# Altium project 10scm153adp1.PrjPcb
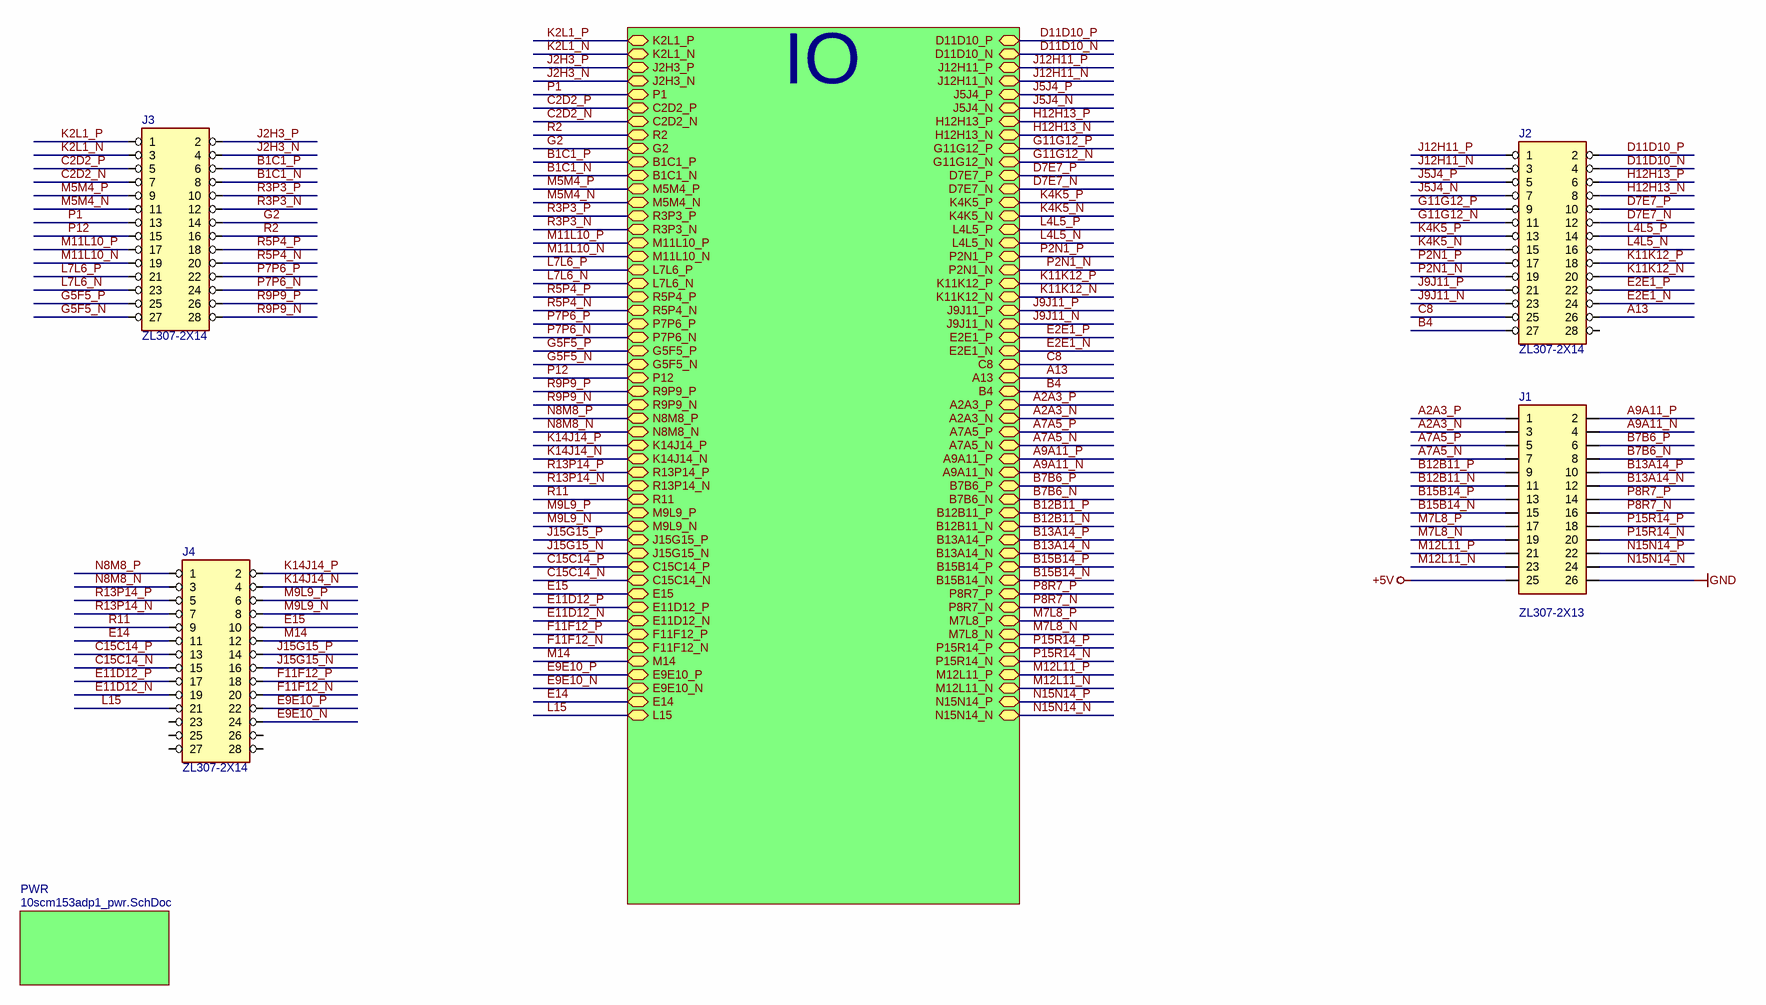
[diagram p0: 10scm153adp1_main.SchDoc]
NazwaModuluSkrot: 10scm153adp1; Projektowal: M. Lach
3 sheets, 36 parts. Net scope: hierarchical (ports join the sheet entries above them; power ports are global).
Board file: 10scm153adp1.PcbDoc
Sheets:
  10scm153adp1_main.SchDoc
    IO = 10scm153adp1_io.SchDoc
    PWR = 10scm153adp1_pwr.SchDoc

## Sheet 10scm153adp1_main.SchDoc
size A3; DocumentNumber: 1; SheetNumber: 1; SheetTotal: 3

### Parts
J1  ZL307-2X13  [ZL307-2X13]
J2  ZL307-2X14  [ZL307-2X14]
J3  ZL307-2X14  [ZL307-2X14]
J4  ZL307-2X14  [ZL307-2X14]

### Sub-sheets
IO = 10scm153adp1_io.SchDoc: P1 (bidir), R2 (bidir), G2 (bidir), P12 (bidir), R11 (bidir), E15 (bidir), M14 (bidir), E14 (bidir), L15 (bidir), C8 (bidir), A13 (bidir), B4 (bidir), M5M4_N (bidir), M5M4_P (bidir), R3P3_N (bidir), R3P3_P (bidir), L7L6_N (bidir), L7L6_P (bidir), R5P4_P (bidir), R5P4_N (bidir), P7P6_P (bidir), P7P6_N (bidir), P8R7_P (bidir), P8R7_N (bidir), M7L8_P (bidir), M7L8_N (bidir), R9P9_N (bidir), R9P9_P (bidir), N8M8_P (bidir), N8M8_N (bidir), P15R14_P (bidir), P15R14_N (bidir), M12L11_P (bidir), M12L11_N (bidir), N15N14_N (bidir), N15N14_P (bidir), K11K12_P (bidir), K11K12_N (bidir), J9J11_N (bidir), J9J11_P (bidir), M9L9_P (bidir), M9L9_N (bidir), M11L10_N (bidir), M11L10_P (bidir), R13P14_P (bidir), R13P14_N (bidir), K14J14_P (bidir), K14J14_N (bidir), J15G15_N (bidir), J15G15_P (bidir), C15C14_N (bidir), C15C14_P (bidir), E11D12_N (bidir), E11D12_P (bidir), F11F12_P (bidir), F11F12_N (bidir), C2D2_N (bidir), C2D2_P (bidir), B1C1_P (bidir), B1C1_N (bidir), E2E1_P (bidir), E2E1_N (bidir), G5F5_N (bidir), G5F5_P (bidir), J2H3_N (bidir), J2H3_P (bidir), K2L1_P (bidir), K2L1_N (bidir), A2A3_N (bidir), A2A3_P (bidir), A7A5_P (bidir), A7A5_N (bidir), A9A11_P (bidir), A9A11_N (bidir), B7B6_P (bidir), B7B6_N (bidir), B12B11_N (bidir), B12B11_P (bidir), B13A14_N (bidir), B13A14_P (bidir), B15B14_N (bidir), B15B14_P (bidir), D7E7_P (bidir), D7E7_N (bidir), D11D10_P (bidir), D11D10_N (bidir), E9E10_P (bidir), E9E10_N (bidir), G11G12_N (bidir), G11G12_P (bidir), H12H13_N (bidir), H12H13_P (bidir), J5J4_P (bidir), J5J4_N (bidir), J12H11_P (bidir), J12H11_N (bidir), K4K5_P (bidir), K4K5_N (bidir), L4L5_P (bidir), L4L5_N (bidir), P2N1_N (bidir), P2N1_P (bidir)
PWR = 10scm153adp1_pwr.SchDoc: no entries

### Nets
+5V: J1.25
GND: J1.26
A2A3_N: J1.3 ; sheet IO/A2A3_N
A2A3_P: J1.1 ; sheet IO/A2A3_P
A7A5_N: J1.7 ; sheet IO/A7A5_N
A7A5_P: J1.5 ; sheet IO/A7A5_P
A9A11_N: J1.4 ; sheet IO/A9A11_N
A9A11_P: J1.2 ; sheet IO/A9A11_P
A13: J2.26 ; sheet IO/A13
B1C1_N: J3.8 ; sheet IO/B1C1_N
B1C1_P: J3.6 ; sheet IO/B1C1_P
B4: J2.27 ; sheet IO/B4
B7B6_N: J1.8 ; sheet IO/B7B6_N
B7B6_P: J1.6 ; sheet IO/B7B6_P
B12B11_N: J1.11 ; sheet IO/B12B11_N
B12B11_P: J1.9 ; sheet IO/B12B11_P
B13A14_N: J1.12 ; sheet IO/B13A14_N
B13A14_P: J1.10 ; sheet IO/B13A14_P
B15B14_N: J1.15 ; sheet IO/B15B14_N
B15B14_P: J1.13 ; sheet IO/B15B14_P
C2D2_N: J3.7 ; sheet IO/C2D2_N
C2D2_P: J3.5 ; sheet IO/C2D2_P
C8: J2.25 ; sheet IO/C8
C15C14_N: J4.15 ; sheet IO/C15C14_N
C15C14_P: J4.13 ; sheet IO/C15C14_P
D7E7_N: J2.12 ; sheet IO/D7E7_N
D7E7_P: J2.10 ; sheet IO/D7E7_P
D11D10_N: J2.4 ; sheet IO/D11D10_N
D11D10_P: J2.2 ; sheet IO/D11D10_P
E2E1_N: J2.24 ; sheet IO/E2E1_N
E2E1_P: J2.22 ; sheet IO/E2E1_P
E9E10_N: J4.24 ; sheet IO/E9E10_N
E9E10_P: J4.22 ; sheet IO/E9E10_P
E11D12_N: J4.19 ; sheet IO/E11D12_N
E11D12_P: J4.17 ; sheet IO/E11D12_P
E14: J4.11 ; sheet IO/E14
E15: J4.10 ; sheet IO/E15
F11F12_N: J4.20 ; sheet IO/F11F12_N
F11F12_P: J4.18 ; sheet IO/F11F12_P
G2: J3.14 ; sheet IO/G2
G5F5_N: J3.27 ; sheet IO/G5F5_N
G5F5_P: J3.25 ; sheet IO/G5F5_P
G11G12_N: J2.11 ; sheet IO/G11G12_N
G11G12_P: J2.9 ; sheet IO/G11G12_P
H12H13_N: J2.8 ; sheet IO/H12H13_N
H12H13_P: J2.6 ; sheet IO/H12H13_P
J2H3_N: J3.4 ; sheet IO/J2H3_N
J2H3_P: J3.2 ; sheet IO/J2H3_P
J5J4_N: J2.7 ; sheet IO/J5J4_N
J5J4_P: J2.5 ; sheet IO/J5J4_P
J9J11_N: J2.23 ; sheet IO/J9J11_N
J9J11_P: J2.21 ; sheet IO/J9J11_P
J12H11_N: J2.3 ; sheet IO/J12H11_N
J12H11_P: J2.1 ; sheet IO/J12H11_P
J15G15_N: J4.16 ; sheet IO/J15G15_N
J15G15_P: J4.14 ; sheet IO/J15G15_P
K2L1_N: J3.3 ; sheet IO/K2L1_N
K2L1_P: J3.1 ; sheet IO/K2L1_P
K4K5_N: J2.15 ; sheet IO/K4K5_N
K4K5_P: J2.13 ; sheet IO/K4K5_P
K11K12_N: J2.20 ; sheet IO/K11K12_N
K11K12_P: J2.18 ; sheet IO/K11K12_P
K14J14_N: J4.4 ; sheet IO/K14J14_N
K14J14_P: J4.2 ; sheet IO/K14J14_P
L4L5_N: J2.16 ; sheet IO/L4L5_N
L4L5_P: J2.14 ; sheet IO/L4L5_P
L7L6_N: J3.23 ; sheet IO/L7L6_N
L7L6_P: J3.21 ; sheet IO/L7L6_P
L15: J4.21 ; sheet IO/L15
M5M4_N: J3.11 ; sheet IO/M5M4_N
M5M4_P: J3.9 ; sheet IO/M5M4_P
M7L8_N: J1.19 ; sheet IO/M7L8_N
M7L8_P: J1.17 ; sheet IO/M7L8_P
M9L9_N: J4.8 ; sheet IO/M9L9_N
M9L9_P: J4.6 ; sheet IO/M9L9_P
M11L10_N: J3.19 ; sheet IO/M11L10_N
M11L10_P: J3.17 ; sheet IO/M11L10_P
M12L11_N: J1.23 ; sheet IO/M12L11_N
M12L11_P: J1.21 ; sheet IO/M12L11_P
M14: J4.12 ; sheet IO/M14
N8M8_N: J4.3 ; sheet IO/N8M8_N
N8M8_P: J4.1 ; sheet IO/N8M8_P
N15N14_N: J1.24 ; sheet IO/N15N14_N
N15N14_P: J1.22 ; sheet IO/N15N14_P
P1: J3.13 ; sheet IO/P1
P2N1_N: J2.19 ; sheet IO/P2N1_N
P2N1_P: J2.17 ; sheet IO/P2N1_P
P7P6_N: J3.24 ; sheet IO/P7P6_N
P7P6_P: J3.22 ; sheet IO/P7P6_P
P8R7_N: J1.16 ; sheet IO/P8R7_N
P8R7_P: J1.14 ; sheet IO/P8R7_P
P12: J3.15 ; sheet IO/P12
P15R14_N: J1.20 ; sheet IO/P15R14_N
P15R14_P: J1.18 ; sheet IO/P15R14_P
R2: J3.16 ; sheet IO/R2
R3P3_N: J3.12 ; sheet IO/R3P3_N
R3P3_P: J3.10 ; sheet IO/R3P3_P
R5P4_N: J3.20 ; sheet IO/R5P4_N
R5P4_P: J3.18 ; sheet IO/R5P4_P
R9P9_N: J3.28 ; sheet IO/R9P9_N
R9P9_P: J3.26 ; sheet IO/R9P9_P
R11: J4.9 ; sheet IO/R11
R13P14_N: J4.7 ; sheet IO/R13P14_N
R13P14_P: J4.5 ; sheet IO/R13P14_P

Not connected (* = marked no-connect by the designer): J2 28; J4 23 25 26 27 28

### Notes on the sheet
- Nazwa modułu (skrót)
- Słowna nazwa modułu
- Rozmiar arkusza
- A3
- Zatwierdził
- Projektował
- Rysował
- Podpis
- ATM
- Data:
- Ark.
- z
- Wer.

### Library data of the parts
J1 = CON85: Kod: CON85; ID: 85; Descript: Gniazdo; kołkowe; żeńskie; PIN: 80; toczone styki; proste; 2,54mm, wycięte 2x13 pinów; Reference5: ZL307-2X40; Typ5: DS1002-03-2*40131; Replacement: bd; Value: ZL307-2X13; Price5: 12; DateOfPrice5: 05-01-2021; Supplier5: tme; Manufacturer5: Connfly
J2-J4 = CON84: Kod: CON84; ID: 84; Descript: Gniazdo; kołkowe; żeńskie; PIN: 80; toczone styki; proste; 2,54mm, wycięte 2x14 pinów; Reference5: ZL307-2X40; Typ5: DS1002-03-2*40131; Replacement: bd; Value: ZL307-2X14; Price5: 20; DateOfPrice5: 05-01-2021; Supplier5: tme; Manufacturer5: Connfly

## Sheet 10scm153adp1_io.SchDoc
size A3; DocumentNumber: 2; SheetNumber: 2; SheetTotal: 3
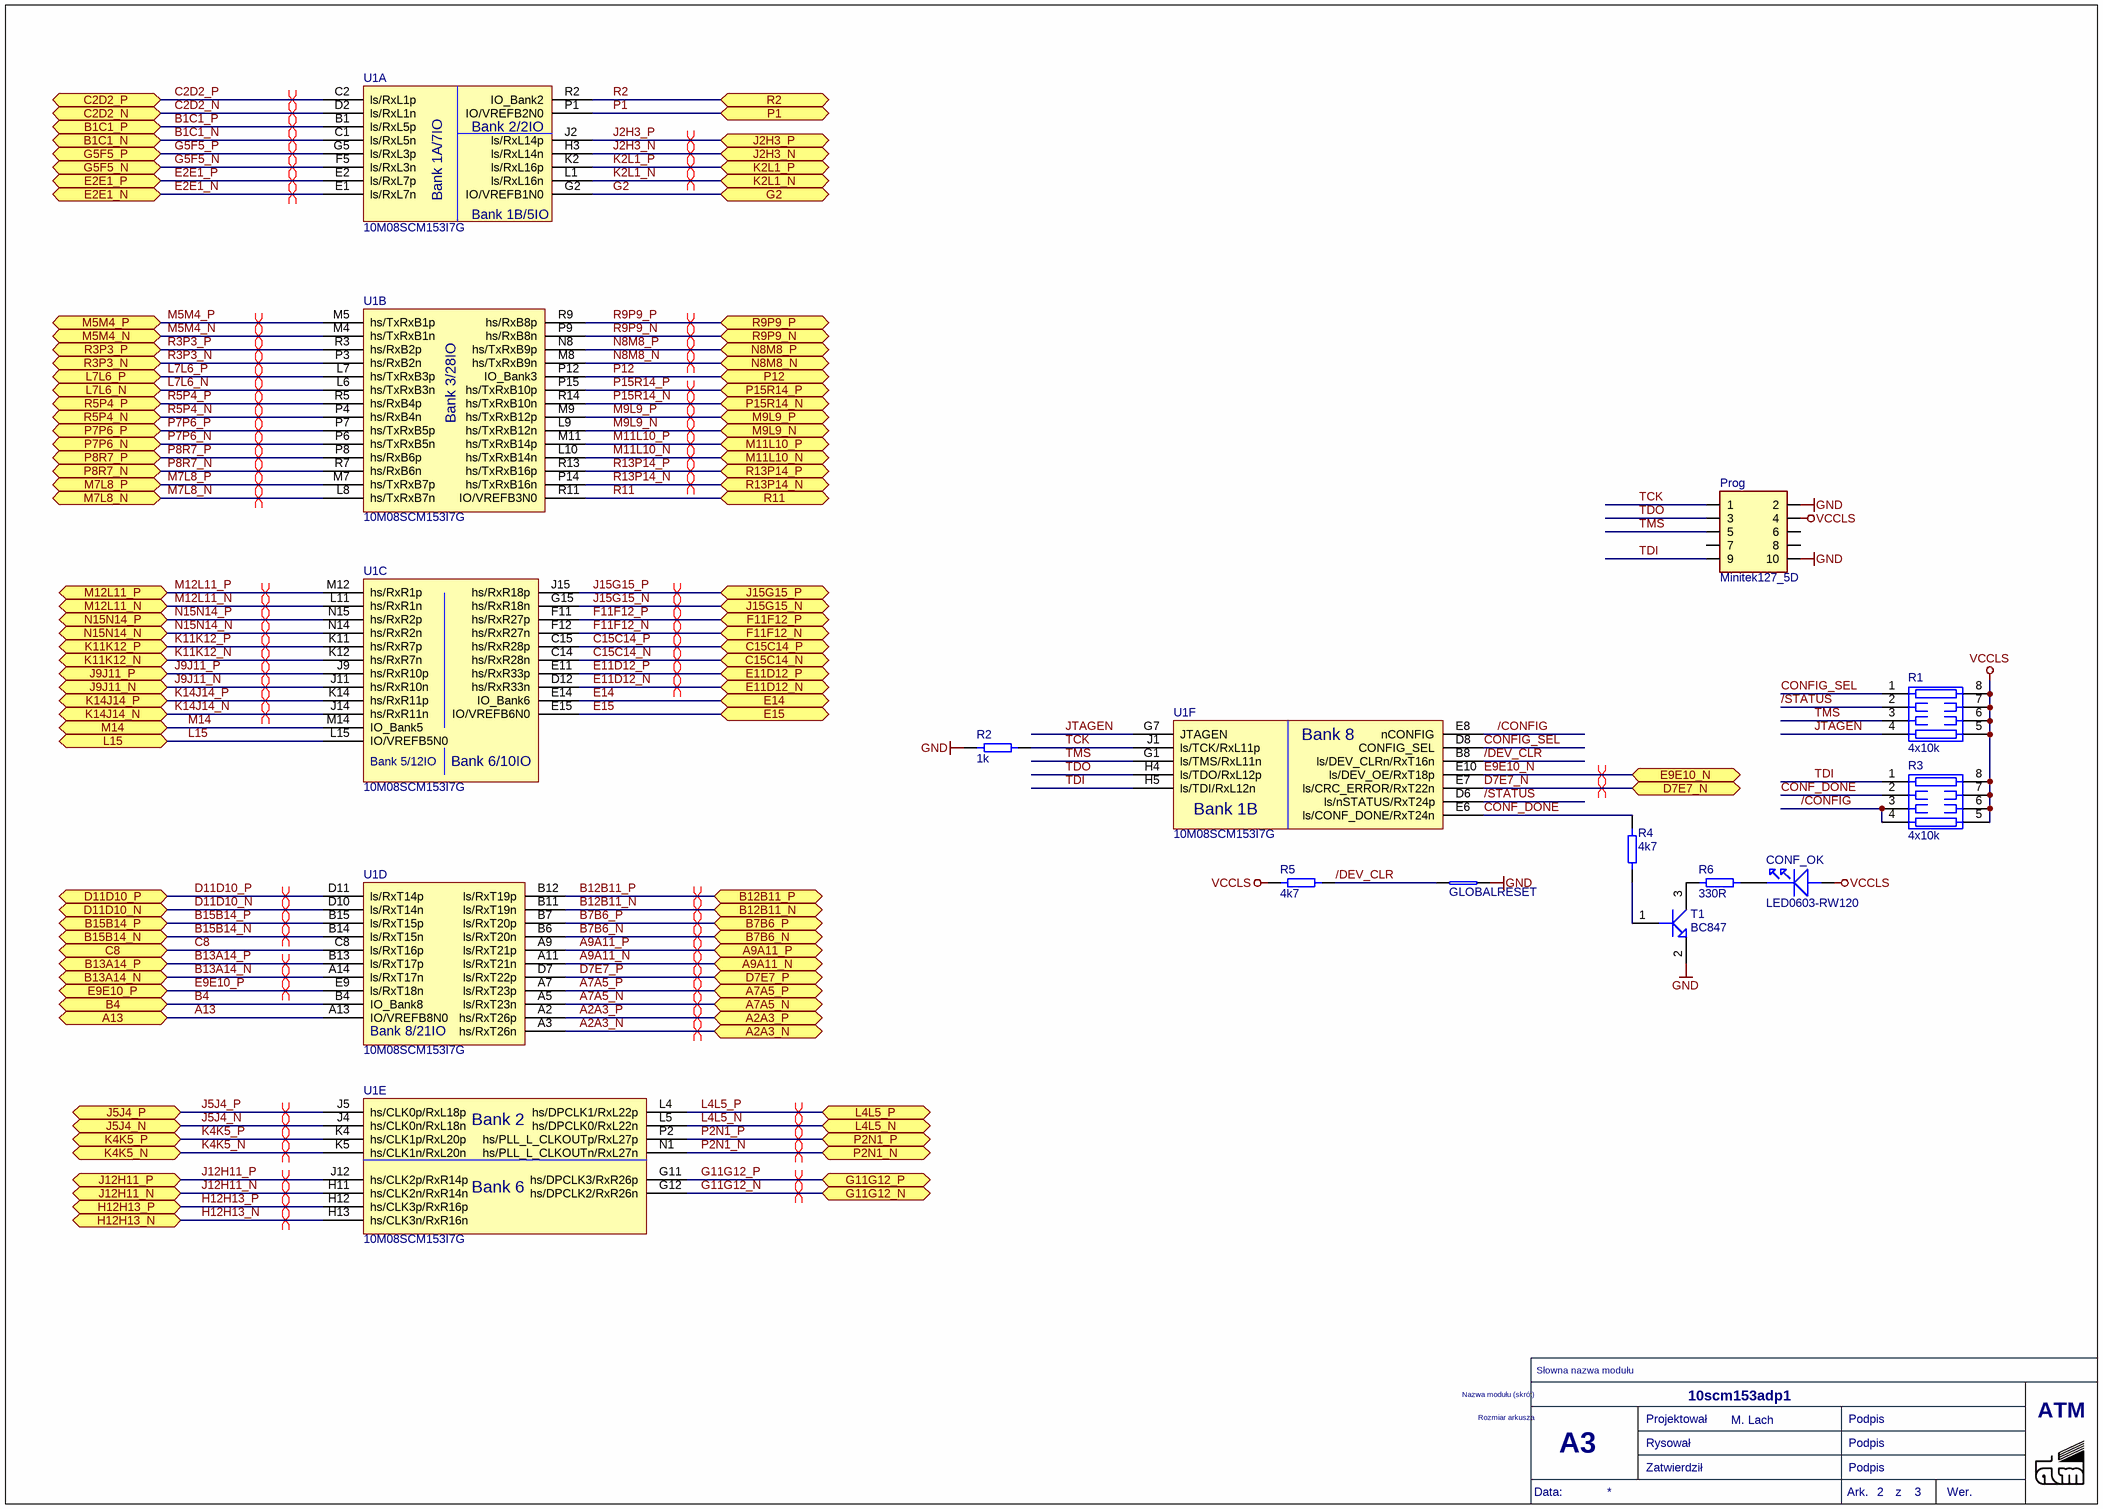
[diagram p1: 10scm153adp1_io.SchDoc]

### Parts
CONF_OK  LED0603-RW120  [D0603]
GLOBALRESET  SHORT0805  [SHORT0805]  (value not drawn)
Prog  Minitek127_5D  [MINITEK127_5D]
R1  4x10k  [1206RP]
R2  1k  [0603R]
R3  4x10k  [1206RP]
R4  4k7  [0603R]
R5  4k7  [0603R]
R6  330R  [0603R]
T1  BC847  [SOT23-3]
U1  10M08SCM153I7G  [MBGA153x15]  (parts A,B,C,D,E,F of 8)

### Ports
A2A3_N (bidir), A2A3_P (bidir), A7A5_N (bidir), A7A5_P (bidir), A9A11_N (bidir), A9A11_P (bidir), A13 (bidir), B1C1_N (bidir), B1C1_P (bidir), B4 (bidir), B7B6_N (bidir), B7B6_P (bidir), B12B11_N (bidir), B12B11_P (bidir), B13A14_N (bidir), B13A14_P (bidir), B15B14_N (bidir), B15B14_P (bidir), C2D2_N (bidir), C2D2_P (bidir), C8 (bidir), C15C14_N (bidir), C15C14_P (bidir), D7E7_N (bidir), D7E7_P (bidir), D11D10_N (bidir), D11D10_P (bidir), E2E1_N (bidir), E2E1_P (bidir), E9E10_N (bidir), E9E10_P (bidir), E11D12_N (bidir), E11D12_P (bidir), E14 (bidir), E15 (bidir), F11F12_N (bidir), F11F12_P (bidir), G2 (bidir), G5F5_N (bidir), G5F5_P (bidir), G11G12_N (bidir), G11G12_P (bidir), H12H13_N (bidir), H12H13_P (bidir), J2H3_N (bidir), J2H3_P (bidir), J5J4_N (bidir), J5J4_P (bidir), J9J11_N (bidir), J9J11_P (bidir), J12H11_N (bidir), J12H11_P (bidir), J15G15_N (bidir), J15G15_P (bidir), K2L1_N (bidir), K2L1_P (bidir), K4K5_N (bidir), K4K5_P (bidir), K11K12_N (bidir), K11K12_P (bidir), K14J14_N (bidir), K14J14_P (bidir), L4L5_N (bidir), L4L5_P (bidir), L7L6_N (bidir), L7L6_P (bidir), L15 (bidir), M5M4_N (bidir), M5M4_P (bidir), M7L8_N (bidir), M7L8_P (bidir), M9L9_N (bidir), M9L9_P (bidir), M11L10_N (bidir), M11L10_P (bidir), M12L11_N (bidir), M12L11_P (bidir), M14 (bidir), N8M8_N (bidir), N8M8_P (bidir), N15N14_N (bidir), N15N14_P (bidir), P1 (bidir), P2N1_N (bidir), P2N1_P (bidir), P7P6_N (bidir), P7P6_P (bidir), P8R7_N (bidir), P8R7_P (bidir), P12 (bidir), P15R14_N (bidir), P15R14_P (bidir), R2 (bidir), R3P3_N (bidir), R3P3_P (bidir), R5P4_N (bidir), R5P4_P (bidir), R9P9_N (bidir), R9P9_P (bidir), R11 (bidir), R13P14_N (bidir), R13P14_P (bidir)

### Nets
GND: GLOBALRESET.2 Prog.2 Prog.10 R2.1 T1.2
VCCLS: CONF_OK.ANOD Prog.4 R1.5(R5) R1.6(R6) R1.7(R7) R1.8(R8) R3.5(R5) R3.6(R6) R3.7(R7) R3.8(R8) R5.2
/CONFIG: R3.3(R3) R3.4(R4) U1.E8(nCONFIG)
/DEV_CLR: GLOBALRESET.1 R5.1 U1.B8(ls/DEV_CLRn/RxT16n)
/STATUS: R1.2(R2) U1.D6(ls/nSTATUS/RxT24p)
A2A3_N: U1.A3(hs/RxT26n) ; port A2A3_N
A2A3_P: U1.A2(hs/RxT26p) ; port A2A3_P
A7A5_N: U1.A5(ls/RxT23n) ; port A7A5_N
A7A5_P: U1.A7(ls/RxT23p) ; port A7A5_P
A9A11_N: U1.A11(ls/RxT21n) ; port A9A11_N
A9A11_P: U1.A9(ls/RxT21p) ; port A9A11_P
A13: U1.A13(IO/VREFB8N0) ; port A13
B1C1_N: U1.C1(ls/RxL5n) ; port B1C1_N
B1C1_P: U1.B1(ls/RxL5p) ; port B1C1_P
B4: U1.B4(IO_Bank8) ; port B4
B7B6_N: U1.B6(ls/RxT20n) ; port B7B6_N
B7B6_P: U1.B7(ls/RxT20p) ; port B7B6_P
B12B11_N: U1.B11(ls/RxT19n) ; port B12B11_N
B12B11_P: U1.B12(ls/RxT19p) ; port B12B11_P
B13A14_N: U1.A14(ls/RxT17n) ; port B13A14_N
B13A14_P: U1.B13(ls/RxT17p) ; port B13A14_P
B15B14_N: U1.B14(ls/RxT15n) ; port B15B14_N
B15B14_P: U1.B15(ls/RxT15p) ; port B15B14_P
C2D2_N: U1.D2(ls/RxL1n) ; port C2D2_N
C2D2_P: U1.C2(ls/RxL1p) ; port C2D2_P
C8: U1.C8(ls/RxT16p) ; port C8
C15C14_N: U1.C14(hs/RxR28n) ; port C15C14_N
C15C14_P: U1.C15(hs/RxR28p) ; port C15C14_P
CONF_DONE: R3.2(R2) R4.1 U1.E6(ls/CONF_DONE/RxT24n)
CONFIG_SEL: R1.1(R1) U1.D8(CONFIG_SEL)
D7E7_N: U1.E7(ls/CRC_ERROR/RxT22n) ; port D7E7_N
D7E7_P: U1.D7(ls/RxT22p) ; port D7E7_P
D11D10_N: U1.D10(ls/RxT14n) ; port D11D10_N
D11D10_P: U1.D11(ls/RxT14p) ; port D11D10_P
E2E1_N: U1.E1(ls/RxL7n) ; port E2E1_N
E2E1_P: U1.E2(ls/RxL7p) ; port E2E1_P
E9E10_N: U1.E10(ls/DEV_OE/RxT18p) ; port E9E10_N
E9E10_P: U1.E9(ls/RxT18n) ; port E9E10_P
E11D12_N: U1.D12(hs/RxR33n) ; port E11D12_N
E11D12_P: U1.E11(hs/RxR33p) ; port E11D12_P
E14: U1.E14(IO_Bank6) ; port E14
E15: U1.E15(IO/VREFB6N0) ; port E15
F11F12_N: U1.F12(hs/RxR27n) ; port F11F12_N
F11F12_P: U1.F11(hs/RxR27p) ; port F11F12_P
G2: U1.G2(IO/VREFB1N0) ; port G2
G5F5_N: U1.F5(ls/RxL3n) ; port G5F5_N
G5F5_P: U1.G5(ls/RxL3p) ; port G5F5_P
G11G12_N: U1.G12(hs/DPCLK2/RxR26n) ; port G11G12_N
G11G12_P: U1.G11(hs/DPCLK3/RxR26p) ; port G11G12_P
H12H13_N: U1.H13(hs/CLK3n/RxR16n) ; port H12H13_N
H12H13_P: U1.H12(hs/CLK3p/RxR16p) ; port H12H13_P
J2H3_N: U1.H3(ls/RxL14n) ; port J2H3_N
J2H3_P: U1.J2(ls/RxL14p) ; port J2H3_P
J5J4_N: U1.J4(hs/CLK0n/RxL18n) ; port J5J4_N
J5J4_P: U1.J5(hs/CLK0p/RxL18p) ; port J5J4_P
J9J11_N: U1.J11(hs/RxR10n) ; port J9J11_N
J9J11_P: U1.J9(hs/RxR10p) ; port J9J11_P
J12H11_N: U1.H11(hs/CLK2n/RxR14n) ; port J12H11_N
J12H11_P: U1.J12(hs/CLK2p/RxR14p) ; port J12H11_P
J15G15_N: U1.G15(hs/RxR18n) ; port J15G15_N
J15G15_P: U1.J15(hs/RxR18p) ; port J15G15_P
JTAGEN: R1.4(R4) U1.G7(JTAGEN)
K2L1_N: U1.L1(ls/RxL16n) ; port K2L1_N
K2L1_P: U1.K2(ls/RxL16p) ; port K2L1_P
K4K5_N: U1.K5(hs/CLK1n/RxL20n) ; port K4K5_N
K4K5_P: U1.K4(hs/CLK1p/RxL20p) ; port K4K5_P
K11K12_N: U1.K12(hs/RxR7n) ; port K11K12_N
K11K12_P: U1.K11(hs/RxR7p) ; port K11K12_P
K14J14_N: U1.J14(hs/RxR11n) ; port K14J14_N
K14J14_P: U1.K14(hs/RxR11p) ; port K14J14_P
L4L5_N: U1.L5(hs/DPCLK0/RxL22n) ; port L4L5_N
L4L5_P: U1.L4(hs/DPCLK1/RxL22p) ; port L4L5_P
L7L6_N: U1.L6(hs/TxRxB3n) ; port L7L6_N
L7L6_P: U1.L7(hs/TxRxB3p) ; port L7L6_P
L15: U1.L15(IO/VREFB5N0) ; port L15
M5M4_N: U1.M4(hs/TxRxB1n) ; port M5M4_N
M5M4_P: U1.M5(hs/TxRxB1p) ; port M5M4_P
M7L8_N: U1.L8(hs/TxRxB7n) ; port M7L8_N
M7L8_P: U1.M7(hs/TxRxB7p) ; port M7L8_P
M9L9_N: U1.L9(hs/TxRxB12n) ; port M9L9_N
M9L9_P: U1.M9(hs/TxRxB12p) ; port M9L9_P
M11L10_N: U1.L10(hs/TxRxB14n) ; port M11L10_N
M11L10_P: U1.M11(hs/TxRxB14p) ; port M11L10_P
M12L11_N: U1.L11(hs/RxR1n) ; port M12L11_N
M12L11_P: U1.M12(hs/RxR1p) ; port M12L11_P
M14: U1.M14(IO_Bank5) ; port M14
N8M8_N: U1.M8(hs/TxRxB9n) ; port N8M8_N
N8M8_P: U1.N8(hs/TxRxB9p) ; port N8M8_P
N15N14_N: U1.N14(hs/RxR2n) ; port N15N14_N
N15N14_P: U1.N15(hs/RxR2p) ; port N15N14_P
P1: U1.P1(IO/VREFB2N0) ; port P1
P2N1_N: U1.N1(hs/PLL_L_CLKOUTn/RxL27n) ; port P2N1_N
P2N1_P: U1.P2(hs/PLL_L_CLKOUTp/RxL27p) ; port P2N1_P
P7P6_N: U1.P6(hs/TxRxB5n) ; port P7P6_N
P7P6_P: U1.P7(hs/TxRxB5p) ; port P7P6_P
P8R7_N: U1.R7(hs/RxB6n) ; port P8R7_N
P8R7_P: U1.P8(hs/RxB6p) ; port P8R7_P
P12: U1.P12(IO_Bank3) ; port P12
P15R14_N: U1.R14(hs/TxRxB10n) ; port P15R14_N
P15R14_P: U1.P15(hs/TxRxB10p) ; port P15R14_P
R2: U1.R2(IO_Bank2) ; port R2
R3P3_N: U1.P3(hs/RxB2n) ; port R3P3_N
R3P3_P: U1.R3(hs/RxB2p) ; port R3P3_P
R5P4_N: U1.P4(hs/RxB4n) ; port R5P4_N
R5P4_P: U1.R5(hs/RxB4p) ; port R5P4_P
R9P9_N: U1.P9(hs/RxB8n) ; port R9P9_N
R9P9_P: U1.R9(hs/RxB8p) ; port R9P9_P
R11: U1.R11(IO/VREFB3N0) ; port R11
R13P14_N: U1.P14(hs/TxRxB16n) ; port R13P14_N
R13P14_P: U1.R13(hs/TxRxB16p) ; port R13P14_P
TCK: Prog.1 R2.2 U1.J1(ls/TCK/RxL11p)
TDI: Prog.9 R3.1(R1) U1.H5(ls/TDI/RxL12n)
TDO: Prog.3 U1.H4(ls/TDO/RxL12p)
TMS: Prog.5 R1.3(R3) U1.G1(ls/TMS/RxL11n)
NetCONF_OK_CATH: CONF_OK.CATH R6.2
NetR4_2: R4.2 T1.1
NetR6_1: R6.1 T1.3

Not connected (* = marked no-connect by the designer): Prog 6 7 8

### Layout directives
differential pair: A2A3_N, A2A3_P, A7A5_N, A7A5_P, A9A11_N, A9A11_P, B1C1_N, B1C1_P, B7B6_N, B7B6_P, B12B11_N, B12B11_P, B13A14_N, B13A14_P, B15B14_N, B15B14_P, C2D2_N, C2D2_P, C15C14_N, C15C14_P, D7E7_N, D7E7_P, D11D10_N, D11D10_P, E2E1_N, E2E1_P, E9E10_N, E9E10_P, E11D12_N, E11D12_P, F11F12_N, F11F12_P, G5F5_N, G5F5_P, G11G12_N, G11G12_P, H12H13_N, H12H13_P, J2H3_N, J2H3_P, J5J4_N, J5J4_P, J9J11_N, J9J11_P, J12H11_N, J12H11_P, J15G15_N, J15G15_P, K2L1_N, K2L1_P, K4K5_N, K4K5_P, K11K12_N, K11K12_P, K14J14_N, K14J14_P, L4L5_N, L4L5_P, L7L6_N, L7L6_P, M5M4_N, M5M4_P, M7L8_N, M7L8_P, M9L9_N, M9L9_P, M11L10_N, M11L10_P, M12L11_N, M12L11_P, N8M8_N, N8M8_P, N15N14_N, N15N14_P, P2N1_N, P2N1_P, P7P6_N, P7P6_P, P8R7_N, P8R7_P, P15R14_N, P15R14_P, R3P3_N, R3P3_P, R5P4_N, R5P4_P, R9P9_N, R9P9_P, R13P14_N, R13P14_P

### Notes on the sheet
- Nazwa modułu (skrót)
- Słowna nazwa modułu
- Rozmiar arkusza
- A3
- Zatwierdził
- Projektował
- Rysował
- Podpis
- ATM
- Data:
- Ark.
- z
- Wer.
- (in symbol ICs341, part A) Bank 2/2IO; Bank 1A/7IO; Bank 1B/5IO
- (in symbol ICs341, part B) Bank 3/28IO
- (in symbol ICs341, part C) Bank 5/12IO; Bank 6/10IO
- (in symbol ICs341, part D) Bank 8/21IO
- (in symbol ICs341, part E) Bank 2; Bank 6
- (in symbol ICs341, part F) Bank 8; Bank 1B

### Library data of the parts
CONF_OK = Opt25: Kod: Opt25; ID: 25; Descript: Dioda LED, SMD 0603, Czerwona 626-636nm, 50-70 mCd /10mA, water clear, 120°; Value: LED0603-RW120; Price5: 0,12; DateOfPrice5: 10-05-2020; Supplier5: maritex.com.pl; Reference5: LED0603-RW120; Manufacturer5: Honglitronic; Typ5: LED0603-RW120
GLOBALRESET = Res238: Kod: Res238; ID: 238; Descript: Przewlekana zwora z drutu na planie rezystora 0805; Value: SHORT0805; Price5: 0,1; Supplier5: -; Reference5: -; Manufacturer5: -; Typ5: -
Prog = CON83: Kod: CON83; ID: 83; Descript: Gniazdo; IDC; Minitek127; męskie; PIN: 10; pionowe; 1,27mm; SMT; 2x5; Reference5: 20021221-00010C4LF; Replacement: bd; Value: Minitek127_5D; Price5: 3,5; DateOfPrice5: 29-12-2020; Supplier5: tme; Manufacturer5: Amphenol; Typ5: 20021221-00010C4LF
R1 R3 = Res287: Kod: Res287; ID: 287; Descript: Drabinka rezystorowa: Y; 10kΩ; SMD; 1206; Il.rezystorów: 4; 63mW; Reference5: DR1206-10K-4/8; Typ5: 4D03WGJ0103T5E; Value: 4x10k; Price5: 0,1; DateOfPrice5: 29-12-2020; Supplier5: tme; Manufacturer5: Royal Ohm
R2 = Res52: Kod: Res52; ID: 52; Descript: Rezystor: thick film; SMD; 0603; 1kom; 0,1W; ±1%; -55÷155°C; Reference5: SMD0603-1K-1%; Typ5: 0603SAF1001T5E; Value: 1k; Price5: 0,08; DateOfPrice5: 10-05-2020; Supplier5: tme.pl; Manufacturer5: Royal Ohm
R4 R5 = Res171: Kod: Res171; ID: 171; Descript: Rezystor: thick film; SMD; 0603; 4,7kom; 0,1W; ±1%; -55÷125°C; Reference5: SMD0603-4K7-1%; Typ5: 0603SAF4701T5E; Value: 4k7; Price5: 0,1; DateOfPrice5: 25-06-2020; Supplier5: tme.pl; Manufacturer5: Royal Ohm
R6 = Res127: Kod: Res127; ID: 127; Descript: Rezystor: thick film; SMD; 0603; 330Ω; 0,1W; ±1%; -55÷125°C; Reference5: SMD0603-330R-1%; Typ5: 0603SAF3300T5E; Value: 330R; Price5: 0,1; DateOfPrice5: 25-06-2020; Supplier5: tme.pl; Manufacturer5: Royal Ohm
T1 = Tra11: Kod: Tra11; ID: 11; Descript: SMD transistor 50V 0.1A; Reference5: BC847A.215; Value: BC847; Price5: 0; DateOfPrice5: 01-01-2010; Supplier5: tme.pl; Manufacturer5: NXP; Typ5: BC847A.215
U1 = ICs341: Kod: ICs341; ID: 341; Descript: FPGA - Field Programmable Gate Array non-volatile FPGA, 112 I/O, 153MBGA; Reference5: 989-10M08SCM153I7G; Value: 10M08SCM153I7G; Price5: 100; DateOfPrice5: 29-12-2020; Supplier5: Mouser; Manufacturer5: Intel; Typ5: 10M08SCM153I7G

## Sheet 10scm153adp1_pwr.SchDoc
size A4; DocumentNumber: 3; SheetNumber: 3; SheetTotal: 3
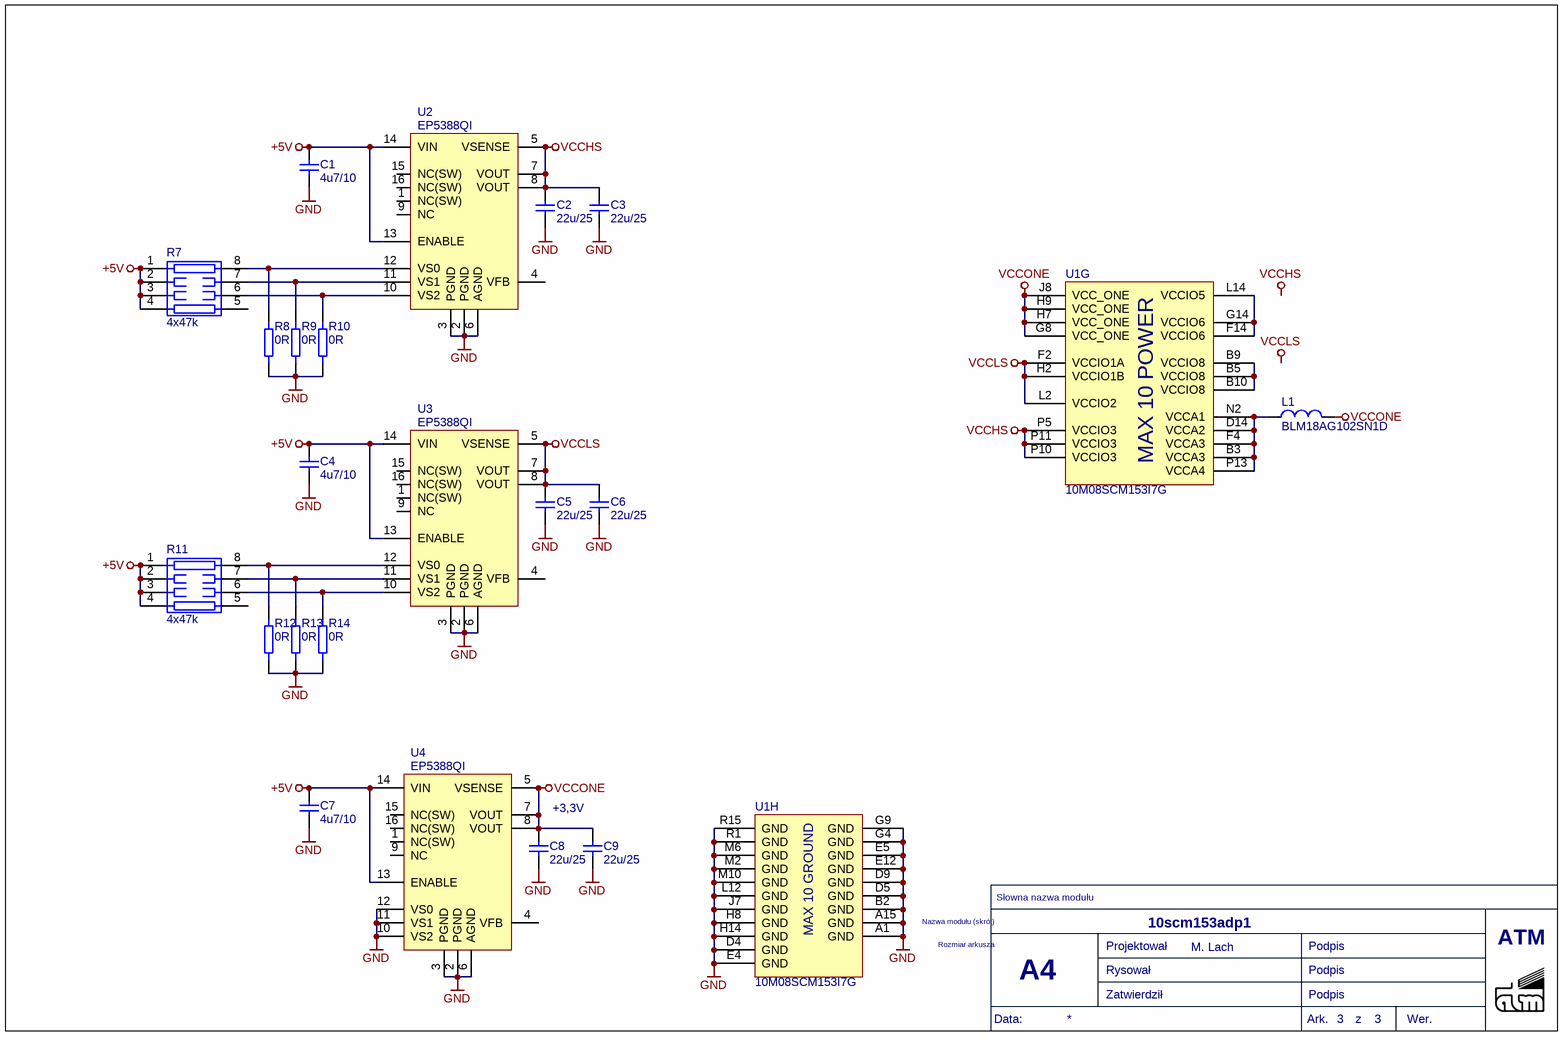
[diagram p2: 10scm153adp1_pwr.SchDoc]

### Parts
C1  4u7/10  [0603-IPC]
C2  22u/25  [0805]
C3  22u/25  [0805]
C4  4u7/10  [0603-IPC]
C5  22u/25  [0805]
C6  22u/25  [0805]
C7  4u7/10  [0603-IPC]
C8  22u/25  [0805]
C9  22u/25  [0805]
L1  BLM18AG102SN1D  [0603-IPC]
R7  4x47k  [1206RP]
R8  0R  [0603R]
R9  0R  [0603R]
R10  0R  [0603R]
R11  4x47k  [1206RP]
R12  0R  [0603R]
R13  0R  [0603R]
R14  0R  [0603R]
U1  10M08SCM153I7G  [MBGA153x15]  (parts G,H of 8)
U2  EP5388QI  [EP5368QI]
U3  EP5388QI  [EP5368QI]
U4  EP5388QI  [EP5368QI]

### Nets
+5V: C1.1 C4.1 C7.1 R7.1(R1) R7.2(R2) R7.3(R3) R7.4(R4) R11.1(R1) R11.2(R2) R11.3(R3) R11.4(R4) U2.13(ENABLE) U2.14(VIN) U3.13(ENABLE) U3.14(VIN) U4.13(ENABLE) U4.14(VIN)
GND: C1.2 C2.2 C3.2 C4.2 C5.2 C6.2 C7.2 C8.2 C9.2 R8.2 R9.2 R10.2 R12.2 R13.2 R14.2 U1.A1(GND) U1.A15(GND) U1.B2(GND) U1.D4(GND) U1.D5(GND) U1.D9(GND) U1.E4(GND) U1.E5(GND) U1.E12(GND) U1.G4(GND) U1.G9(GND) U1.H8(GND) U1.H14(GND) U1.J7(GND) U1.L12(GND) U1.M2(GND) U1.M6(GND) U1.M10(GND) U1.R1(GND) U1.R15(GND) U2.2(PGND) U2.3(PGND) U2.6(AGND) U3.2(PGND) U3.3(PGND) U3.6(AGND) U4.2(PGND) U4.3(PGND) U4.6(AGND) U4.10(VS2) U4.11(VS1) U4.12(VS0)
VCCHS: C2.1 C3.1 U1.P5(VCCIO3) U1.P10(VCCIO3) U1.P11(VCCIO3) U2.5(VSENSE) U2.7(VOUT) U2.8(VOUT)
VCCLS: C5.1 C6.1 U1.F2(VCCIO1A) U1.H2(VCCIO1B) U1.L2(VCCIO2) U3.5(VSENSE) U3.7(VOUT) U3.8(VOUT)
VCCONE: C8.1 C9.1 L1.2 U1.G8(VCC_ONE) U1.H7(VCC_ONE) U1.H9(VCC_ONE) U1.J8(VCC_ONE) U4.5(VSENSE) U4.7(VOUT) U4.8(VOUT)
NetL1_1: L1.1 U1.B3(VCCA3) U1.D14(VCCA2) U1.F4(VCCA3) U1.N2(VCCA1) U1.P13(VCCA4)
NetR7_6: R7.6(R6) R10.1 U2.10(VS2)
NetR7_7: R7.7(R7) R9.1 U2.11(VS1)
NetR7_8: R7.8(R8) R8.1 U2.12(VS0)
NetR11_6: R11.6(R6) R14.1 U3.10(VS2)
NetR11_7: R11.7(R7) R13.1 U3.11(VS1)
NetR11_8: R11.8(R8) R12.1 U3.12(VS0)
NetU1_B5: U1.B5(VCCIO8) U1.B9(VCCIO8) U1.B10(VCCIO8)
NetU1_F14: U1.F14(VCCIO6) U1.G14(VCCIO6) U1.L14(VCCIO5)

Not connected (* = marked no-connect by the designer): R7 5(R5); R11 5(R5); U2 1(NC(SW)) 4(VFB) 9(NC) 15(NC(SW)) 16(NC(SW)); U3 1(NC(SW)) 4(VFB) 9(NC) 15(NC(SW)) 16(NC(SW)); U4 1(NC(SW)) 4(VFB) 9(NC) 15(NC(SW)) 16(NC(SW))

### Notes on the sheet
- +3,3V
- Labels drawn without touching a wire or pin: VCCHS, VCCLS
- Nazwa modułu (skrót)
- Słowna nazwa modułu
- Rozmiar arkusza
- A4
- Zatwierdził
- Projektował
- Rysował
- Podpis
- ATM
- Data:
- Ark.
- z
- Wer.
- (in symbol ICs341, part G) MAX 10 POWER
- (in symbol ICs341, part H) MAX 10 GROUND

### Library data of the parts
C1 C4 C7 = CAP131: Kod: CAP131; ID: 131; Descript: Kondensator: ceramiczny; MLCC; 4,7uF; 10V; X5R; ±10%; SMD; 0603; Reference5: CL10A475KP8NNNC; Value: 4u7/10; Price5: 0; DateOfPrice5: 01-01-2010; Supplier5: tme.pl; Manufacturer5: Samsung; Typ5: CL10A475KP8NNNC
C2 C3 C5 C6 C8 C9 = CAP96: Kod: CAP96; ID: 96; Descript: Kondensator: ceramiczny; MLCC; 22uF; 25V; X5R; ±20%; SMD; 0805; Reference5: CL21A226MAQNNNE; Value: 22u/25; Price5: 1,5; DateOfPrice5: 29-12-2020; Supplier5: tme.pl; Manufacturer5: Samsung; Typ5: CL21A226MAQNNNE
L1 = Ind41: Kod: Ind41; ID: 41; Descript: Ferryt: koralik; Imp.@ 100MHz:1000om; Montaż: SMD; 0,4A; Obud:0603; Value: BLM18AG102SN1D; InductCurr: -; Price5: 0; DateOfPrice5: 10-05-2020; Supplier5: tme.pl; Reference5: BLM18AG102SN1D; Manufacturer5: Murata; Typ5: BLM18AG102SN1D
R7 R11 = Res182: Kod: Res182; ID: 182; Descript: Drabinka rezystorowa: Y; 47kΩ; SMD; 1206; Il.rezystorów:4; 63mW; Reference5: DR1206-47K-4/8; Typ5: 4D03WGJ0473T; Value: 4x47k; Price5: 0,1; DateOfPrice5: 10-05-2020; Supplier5: tme.pl; Manufacturer5: Royal Ohm
R8-R10 R12-R14 = Res1: Kod: Res1; ID: 1; Descript: Rezystor: thick film; SMD; 0603; 0ohm; 0,1W; ±5%; -55÷155°C; Reference5: RC0603JR-070R; Typ5: RC0603JR-070RL; Value: 0R; Price5: 0,1; DateOfPrice5: 25-06-2020; Supplier5: tme.pl; Manufacturer5: Yageo
U1 = ICs341: as U1 on sheet 10scm153adp1_io; Value: 10M08SCM153I7G; Price5: 100; DateOfPrice5: 29-12-2020; Supplier5: Mouser; Manufacturer5: Intel; Typ5: 10M08SCM153I7G
U2-U4 = ICs340: Kod: ICs340; ID: 340; Descript: Switching Voltage Regulators 800mA BUCK REGULATOR INTEGRATED INDUCTOR; Reference5: 884-EP5388QI; Value: EP5388QI; Price5: 15; DateOfPrice5: 29-12-2020; Supplier5: Mouser; Manufacturer5: Intel; Typ5: EP5388QI

## Nets that join several sheets
+5V: 10scm153adp1_main (J1.25), 10scm153adp1_pwr (17 pins)
GND: 10scm153adp1_main (J1.26), 10scm153adp1_io (5 pins), 10scm153adp1_pwr (47 pins)
VCCLS: 10scm153adp1_io (11 pins), 10scm153adp1_pwr (8 pins)
A2A3_N: 10scm153adp1_main (J1.3), 10scm153adp1_io (U1.A3)
A2A3_P: 10scm153adp1_main (J1.1), 10scm153adp1_io (U1.A2)
A7A5_N: 10scm153adp1_main (J1.7), 10scm153adp1_io (U1.A5)
A7A5_P: 10scm153adp1_main (J1.5), 10scm153adp1_io (U1.A7)
A9A11_N: 10scm153adp1_main (J1.4), 10scm153adp1_io (U1.A11)
A9A11_P: 10scm153adp1_main (J1.2), 10scm153adp1_io (U1.A9)
A13: 10scm153adp1_main (J2.26), 10scm153adp1_io (U1.A13)
B1C1_N: 10scm153adp1_main (J3.8), 10scm153adp1_io (U1.C1)
B1C1_P: 10scm153adp1_main (J3.6), 10scm153adp1_io (U1.B1)
B4: 10scm153adp1_main (J2.27), 10scm153adp1_io (U1.B4)
B7B6_N: 10scm153adp1_main (J1.8), 10scm153adp1_io (U1.B6)
B7B6_P: 10scm153adp1_main (J1.6), 10scm153adp1_io (U1.B7)
B12B11_N: 10scm153adp1_main (J1.11), 10scm153adp1_io (U1.B11)
B12B11_P: 10scm153adp1_main (J1.9), 10scm153adp1_io (U1.B12)
B13A14_N: 10scm153adp1_main (J1.12), 10scm153adp1_io (U1.A14)
B13A14_P: 10scm153adp1_main (J1.10), 10scm153adp1_io (U1.B13)
B15B14_N: 10scm153adp1_main (J1.15), 10scm153adp1_io (U1.B14)
B15B14_P: 10scm153adp1_main (J1.13), 10scm153adp1_io (U1.B15)
C2D2_N: 10scm153adp1_main (J3.7), 10scm153adp1_io (U1.D2)
C2D2_P: 10scm153adp1_main (J3.5), 10scm153adp1_io (U1.C2)
C8: 10scm153adp1_main (J2.25), 10scm153adp1_io (U1.C8)
C15C14_N: 10scm153adp1_main (J4.15), 10scm153adp1_io (U1.C14)
C15C14_P: 10scm153adp1_main (J4.13), 10scm153adp1_io (U1.C15)
D7E7_N: 10scm153adp1_main (J2.12), 10scm153adp1_io (U1.E7)
D7E7_P: 10scm153adp1_main (J2.10), 10scm153adp1_io (U1.D7)
D11D10_N: 10scm153adp1_main (J2.4), 10scm153adp1_io (U1.D10)
D11D10_P: 10scm153adp1_main (J2.2), 10scm153adp1_io (U1.D11)
E2E1_N: 10scm153adp1_main (J2.24), 10scm153adp1_io (U1.E1)
E2E1_P: 10scm153adp1_main (J2.22), 10scm153adp1_io (U1.E2)
E9E10_N: 10scm153adp1_main (J4.24), 10scm153adp1_io (U1.E10)
E9E10_P: 10scm153adp1_main (J4.22), 10scm153adp1_io (U1.E9)
E11D12_N: 10scm153adp1_main (J4.19), 10scm153adp1_io (U1.D12)
E11D12_P: 10scm153adp1_main (J4.17), 10scm153adp1_io (U1.E11)
E14: 10scm153adp1_main (J4.11), 10scm153adp1_io (U1.E14)
E15: 10scm153adp1_main (J4.10), 10scm153adp1_io (U1.E15)
F11F12_N: 10scm153adp1_main (J4.20), 10scm153adp1_io (U1.F12)
F11F12_P: 10scm153adp1_main (J4.18), 10scm153adp1_io (U1.F11)
G2: 10scm153adp1_main (J3.14), 10scm153adp1_io (U1.G2)
G5F5_N: 10scm153adp1_main (J3.27), 10scm153adp1_io (U1.F5)
G5F5_P: 10scm153adp1_main (J3.25), 10scm153adp1_io (U1.G5)
G11G12_N: 10scm153adp1_main (J2.11), 10scm153adp1_io (U1.G12)
G11G12_P: 10scm153adp1_main (J2.9), 10scm153adp1_io (U1.G11)
H12H13_N: 10scm153adp1_main (J2.8), 10scm153adp1_io (U1.H13)
H12H13_P: 10scm153adp1_main (J2.6), 10scm153adp1_io (U1.H12)
J2H3_N: 10scm153adp1_main (J3.4), 10scm153adp1_io (U1.H3)
J2H3_P: 10scm153adp1_main (J3.2), 10scm153adp1_io (U1.J2)
J5J4_N: 10scm153adp1_main (J2.7), 10scm153adp1_io (U1.J4)
J5J4_P: 10scm153adp1_main (J2.5), 10scm153adp1_io (U1.J5)
J9J11_N: 10scm153adp1_main (J2.23), 10scm153adp1_io (U1.J11)
J9J11_P: 10scm153adp1_main (J2.21), 10scm153adp1_io (U1.J9)
J12H11_N: 10scm153adp1_main (J2.3), 10scm153adp1_io (U1.H11)
J12H11_P: 10scm153adp1_main (J2.1), 10scm153adp1_io (U1.J12)
J15G15_N: 10scm153adp1_main (J4.16), 10scm153adp1_io (U1.G15)
J15G15_P: 10scm153adp1_main (J4.14), 10scm153adp1_io (U1.J15)
K2L1_N: 10scm153adp1_main (J3.3), 10scm153adp1_io (U1.L1)
K2L1_P: 10scm153adp1_main (J3.1), 10scm153adp1_io (U1.K2)
K4K5_N: 10scm153adp1_main (J2.15), 10scm153adp1_io (U1.K5)
K4K5_P: 10scm153adp1_main (J2.13), 10scm153adp1_io (U1.K4)
K11K12_N: 10scm153adp1_main (J2.20), 10scm153adp1_io (U1.K12)
K11K12_P: 10scm153adp1_main (J2.18), 10scm153adp1_io (U1.K11)
K14J14_N: 10scm153adp1_main (J4.4), 10scm153adp1_io (U1.J14)
K14J14_P: 10scm153adp1_main (J4.2), 10scm153adp1_io (U1.K14)
L4L5_N: 10scm153adp1_main (J2.16), 10scm153adp1_io (U1.L5)
L4L5_P: 10scm153adp1_main (J2.14), 10scm153adp1_io (U1.L4)
L7L6_N: 10scm153adp1_main (J3.23), 10scm153adp1_io (U1.L6)
L7L6_P: 10scm153adp1_main (J3.21), 10scm153adp1_io (U1.L7)
L15: 10scm153adp1_main (J4.21), 10scm153adp1_io (U1.L15)
M5M4_N: 10scm153adp1_main (J3.11), 10scm153adp1_io (U1.M4)
M5M4_P: 10scm153adp1_main (J3.9), 10scm153adp1_io (U1.M5)
M7L8_N: 10scm153adp1_main (J1.19), 10scm153adp1_io (U1.L8)
M7L8_P: 10scm153adp1_main (J1.17), 10scm153adp1_io (U1.M7)
M9L9_N: 10scm153adp1_main (J4.8), 10scm153adp1_io (U1.L9)
M9L9_P: 10scm153adp1_main (J4.6), 10scm153adp1_io (U1.M9)
M11L10_N: 10scm153adp1_main (J3.19), 10scm153adp1_io (U1.L10)
M11L10_P: 10scm153adp1_main (J3.17), 10scm153adp1_io (U1.M11)
M12L11_N: 10scm153adp1_main (J1.23), 10scm153adp1_io (U1.L11)
M12L11_P: 10scm153adp1_main (J1.21), 10scm153adp1_io (U1.M12)
M14: 10scm153adp1_main (J4.12), 10scm153adp1_io (U1.M14)
N8M8_N: 10scm153adp1_main (J4.3), 10scm153adp1_io (U1.M8)
N8M8_P: 10scm153adp1_main (J4.1), 10scm153adp1_io (U1.N8)
N15N14_N: 10scm153adp1_main (J1.24), 10scm153adp1_io (U1.N14)
N15N14_P: 10scm153adp1_main (J1.22), 10scm153adp1_io (U1.N15)
P1: 10scm153adp1_main (J3.13), 10scm153adp1_io (U1.P1)
P2N1_N: 10scm153adp1_main (J2.19), 10scm153adp1_io (U1.N1)
P2N1_P: 10scm153adp1_main (J2.17), 10scm153adp1_io (U1.P2)
P7P6_N: 10scm153adp1_main (J3.24), 10scm153adp1_io (U1.P6)
P7P6_P: 10scm153adp1_main (J3.22), 10scm153adp1_io (U1.P7)
P8R7_N: 10scm153adp1_main (J1.16), 10scm153adp1_io (U1.R7)
P8R7_P: 10scm153adp1_main (J1.14), 10scm153adp1_io (U1.P8)
P12: 10scm153adp1_main (J3.15), 10scm153adp1_io (U1.P12)
P15R14_N: 10scm153adp1_main (J1.20), 10scm153adp1_io (U1.R14)
P15R14_P: 10scm153adp1_main (J1.18), 10scm153adp1_io (U1.P15)
R2: 10scm153adp1_main (J3.16), 10scm153adp1_io (U1.R2)
R3P3_N: 10scm153adp1_main (J3.12), 10scm153adp1_io (U1.P3)
R3P3_P: 10scm153adp1_main (J3.10), 10scm153adp1_io (U1.R3)
R5P4_N: 10scm153adp1_main (J3.20), 10scm153adp1_io (U1.P4)
R5P4_P: 10scm153adp1_main (J3.18), 10scm153adp1_io (U1.R5)
R9P9_N: 10scm153adp1_main (J3.28), 10scm153adp1_io (U1.P9)
R9P9_P: 10scm153adp1_main (J3.26), 10scm153adp1_io (U1.R9)
R11: 10scm153adp1_main (J4.9), 10scm153adp1_io (U1.R11)
R13P14_N: 10scm153adp1_main (J4.7), 10scm153adp1_io (U1.P14)
R13P14_P: 10scm153adp1_main (J4.5), 10scm153adp1_io (U1.R13)